# EAGLE design Screambooth (EAGLE 9.1.1)
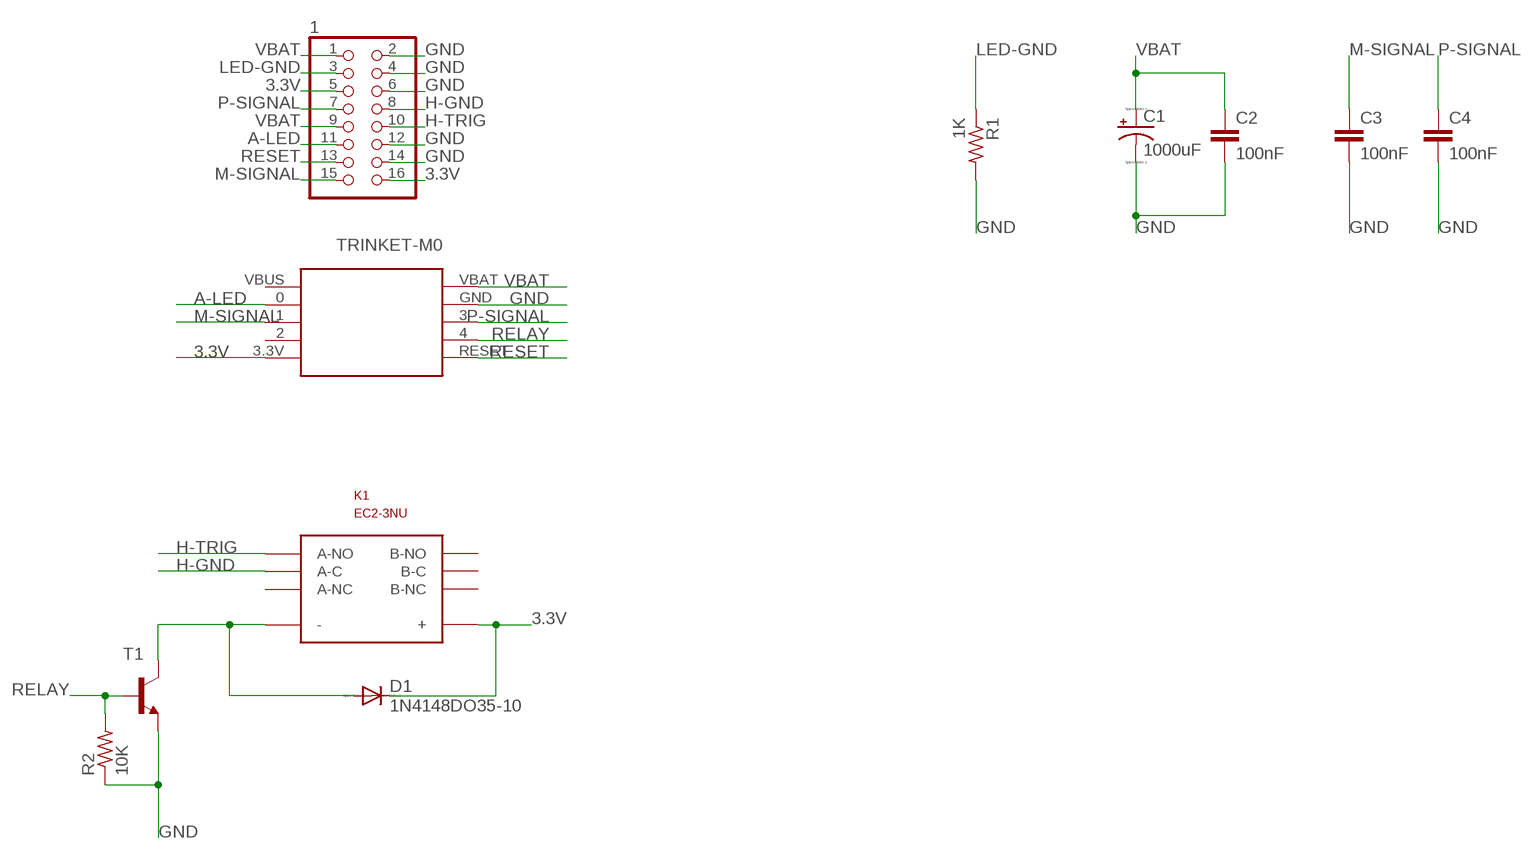
[diagram p0: schematic, sheet 1]

## Parts
1  PINHD-2X8  [2X08]
C1  1000uF  CPOL-USE5-10.5  [E5-10,5]
C2  100nF  C-EU050-030X075  [C050-030X075]
C3  100nF  C-EU050-030X075  [C050-030X075]
C4  100nF  C-EU050-030X075  [C050-030X075]
D1  1N4148DO35-10  [DO35-10]
K1  EC2-3NU  [EC2-RELAY]
R1  1K  R-US_0207/10  [0207/10]
R2  10K  R-US_0207/10  [0207/10]
T1  2N3904  [TO92]
TRINKET-M0  TRINKET-M0  [TRINKET-M0]

## Nets
3.3V: 1.5 1.16 D1.C K1.+ TRINKET-M0.3.3V
A-LED: 1.11 TRINKET-M0.0
GND: 1.2 1.4 1.6 1.12 1.14 C1.- C2.2 C3.2 C4.2 R1.2 R2.1 T1.3(E) TRINKET-M0.GND
H-GND: 1.8 K1.A-C
H-TRIG: 1.10 K1.A-NO
LED-GND: 1.3 R1.1
M-SIGNAL: 1.15 C3.1 TRINKET-M0.1
N$1: D1.A K1.- T1.1(C)
P-SIGNAL: 1.7 C4.1 TRINKET-M0.3
RELAY: R2.2 T1.2(B) TRINKET-M0.4
RESET: 1.13 TRINKET-M0.RESET
VBAT: 1.1 1.9 C1.+ C2.1 TRINKET-M0.VBAT
Unconnected: K1.A-NC K1.B-C K1.B-NC K1.B-NO TRINKET-M0.2 TRINKET-M0.VBUS

## Library data of the parts
1 = pinhead:PINHD-2X8: PIN HEADER
C1 = resistor:CPOL-US: POLARIZED CAPACITOR, American symbol
C2-C4 = resistor:C-EU: CAPACITOR, European symbol
D1 = diode:1N4148: DIODE high speed (Philips)
K1 = jon:EC2-3NU: The KEMET EC2/EE2 miniature signal relays offer a compact case size in a slim package. Minimal board space is consumed with either a through-hole or surface mount configuration. These relays are recognized by UL and CSA, while also being compliant with Part 68 of the FCC’s 1,500 V surge capacity. Coil Voltage 3.3v
R1 R2 = resistor:R-US_: RESISTOR, American symbol
T1 = transistor:2N3904: NPN TRANSISTOR
TRINKET-M0 = jon:TRINKET-M0

## Board
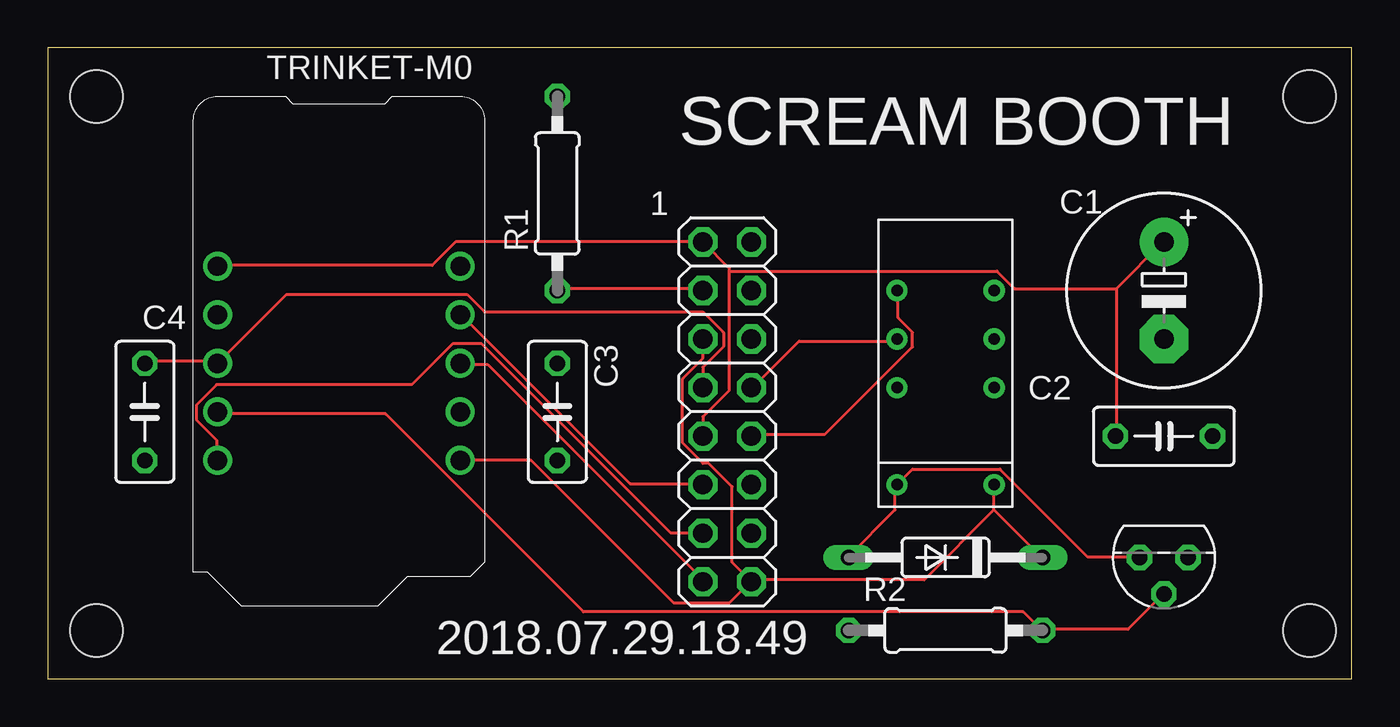
[diagram p1: board, top side]
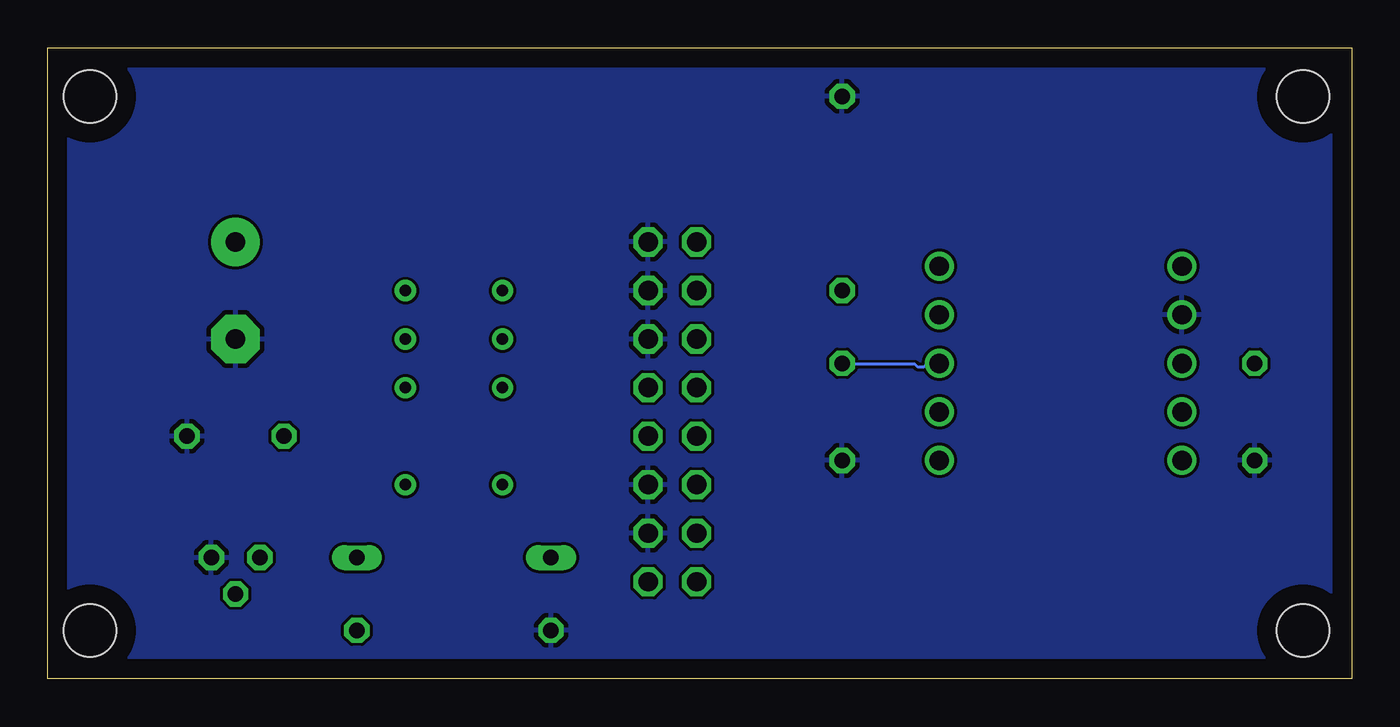
[diagram p2: board, bottom side, seen from below]

Size 68.25 x 33.02 mm. Coordinates in mm from the lower left corner, seen from the top.
Outline: 0,0 68.25,0 68.25,33.02 0,33.02 0,0
Copper layers (1*16): Top 0.035mm / dielectric 1.5mm / Bottom 0.035mm
Design rules "default": minimum track width 6mil, minimum drill 0.35mm, track to track 6mil, track to pad 6mil, pad to pad 6mil, via to via 6mil, smd to smd 6mil, copper to edge 40mil, drill to drill 6mil, minimum pad ring 10mil, minimum via ring 8mil, stop-mask expansion 4mil, vias tented up to drill 0mil, thermal gap 10mil
Holes 2.75 mm at 2.54,30.48 66.04,30.48 2.54,2.54 66.04,2.54

### Footprints (pad centres in the part's own frame; a part is rotated, then mirrored left to right if it is on the bottom)
2X08 = drill 1.016 octagon: 1 -8.89,-1.27; 2 -8.89,1.27; 3 -6.35,-1.27; 4 -6.35,1.27; 5 -3.81,-1.27; 6 -3.81,1.27; 7 -1.27,-1.27; 8 -1.27,1.27; 9 1.27,-1.27; 10 1.27,1.27; 11 3.81,-1.27; 12 3.81,1.27; 13 6.35,-1.27; 14 6.35,1.27; 15 8.89,-1.27; 16 8.89,1.27
E5-10,5 = drill 1.016 pad 2.54: + -2.54,0 | drill 1.016 pad 2.54 octagon: - 2.54,0
C050-030X075 = drill 0.813 octagon: 1 -2.54,0; 2 2.54,0
DO35-10 = drill 0.813 long: A 5.08,0; C -5.08,0
EC2-RELAY = drill 0.6: + 2.54,-6.35; - -2.54,-6.35; A-C -2.54,1.27; A-NC -2.54,-1.27; A-NO -2.54,3.81; B-C 2.54,1.27; B-NC 2.54,-1.27; B-NO 2.54,3.81
0207/10 = drill 0.813 octagon: 1 -5.08,0; 2 5.08,0
TO92 = drill 0.813 octagon: 1 1.27,0; 2 0,1.905; 3 -1.27,0
TRINKET-M0 = drill 1.016: 0 6.35,1.27; 1 6.35,-1.27; 2 6.35,-3.81; 3 -6.35,-1.27; 3.3V 6.35,-6.35; 4 -6.35,-3.81; GND -6.35,1.27; RESET -6.35,-6.35; VBAT -6.35,3.81; VBUS 6.35,3.81

### Placement (x,y rotation side)
1  35.56,13.97 270 top
C1  58.42,20.32 270 top
C2  58.42,12.7 0 top
C3  26.67,13.97 270 top
C4  5.08,13.97 270 top
D1  46.99,6.35 180 top
K1  46.99,16.51 0 top
R1  26.67,25.4 90 top
R2  46.99,2.54 0 top
T1  58.42,6.35 180 top
TRINKET-M0  15.24,17.78 0 top

### Tracks (layer width: path | path; a pad name or v marks a point on that pad's centre or on a via)
3.3V
  Top 0.152: 49.53,8.84 49.53,10.06 K1.+ | 49.53,8.84 51.97,6.4 D1.C | 49.53,8.84 45.87,5.18 36.88,5.18 1.16 | TRINKET-M0.3.3V 21.64,11.43 25.3,11.43 32.77,3.96 35.66,3.96 36.73,5.03 1.16 | 1.5 34.29,17.68 34.29,16.76 33.22,15.7 33.22,12.34 34.29,11.28 34.59,11.28 35.81,10.06 35.81,6.1 36.73,5.18 1.16
A-LED
  Top 0.152: 1.11 34.29,10.21 30.48,10.21 21.64,19.05 TRINKET-M0.0
GND
  pour Bottom: 0,33.02 0,0 68.58,0 68.58,33.02
H-GND
  Top 0.152: K1.A-C 44.35,17.68 39.32,17.68 36.88,15.24 1.8
H-TRIG
  Top 0.152: K1.A-NO 44.5,20.27 44.5,18.9 45.26,18.14 45.26,17.37 40.69,12.8 36.88,12.8 1.10
LED-GND
  Top 0.152: R1.1 26.67,20.42 34.29,20.42 1.3
M-SIGNAL
  Top 0.152: 1.15 34.29,5.18 23.01,16.46 21.64,16.46 TRINKET-M0.1
  Bottom 0.152: C3.1 26.67,16.46 22.86,16.46 22.71,16.31 22.4,16.31 22.25,16.46 21.64,16.46 TRINKET-M0.1
N$1
  Top 0.152: D1.A 41.91,6.4 44.35,8.84 44.35,10.06 K1.- 44.5,10.21 45.26,10.97 49.84,10.97 54.41,6.4 57.15,6.4 T1.1
P-SIGNAL
  Top 0.152: C4.1 5.18,16.61 8.84,16.61 TRINKET-M0.3 8.99,16.61 12.5,20.12 21.95,20.12 22.86,19.2 34.29,19.2 35.36,18.14 35.36,17.37 34.29,16.31 1.7
RELAY
  Top 0.152: T1.2 58.37,4.42 56.54,2.59 52.12,2.59 R2.2 51.97,2.59 51.05,3.5 28.04,3.5 17.68,13.87 8.99,13.87 TRINKET-M0.4
RESET
  Top 0.152: 1.13 32.61,7.62 22.71,17.53 21.18,17.53 19.05,15.39 8.84,15.39 7.77,14.33 7.77,13.56 8.84,12.5 8.84,11.43 TRINKET-M0.RESET
VBAT
  Top 0.152: 55.93,20.42 55.93,12.8 C2.1 | 55.93,20.42 58.37,22.86 C1.+ | TRINKET-M0.VBAT 8.99,21.64 20.12,21.64 21.34,22.86 1.1 35.66,21.49 35.66,21.34 | 35.66,21.34 35.66,15.09 34.29,13.72 34.29,12.8 1.9 | 55.93,20.42 50.6,20.42 49.68,21.34 35.66,21.34

### Text on the board
tPlace: SCREAM BOOTH | 2018.07.29.18.49